# EAGLE design PCM2904_SoundCard (EAGLE 5.10)
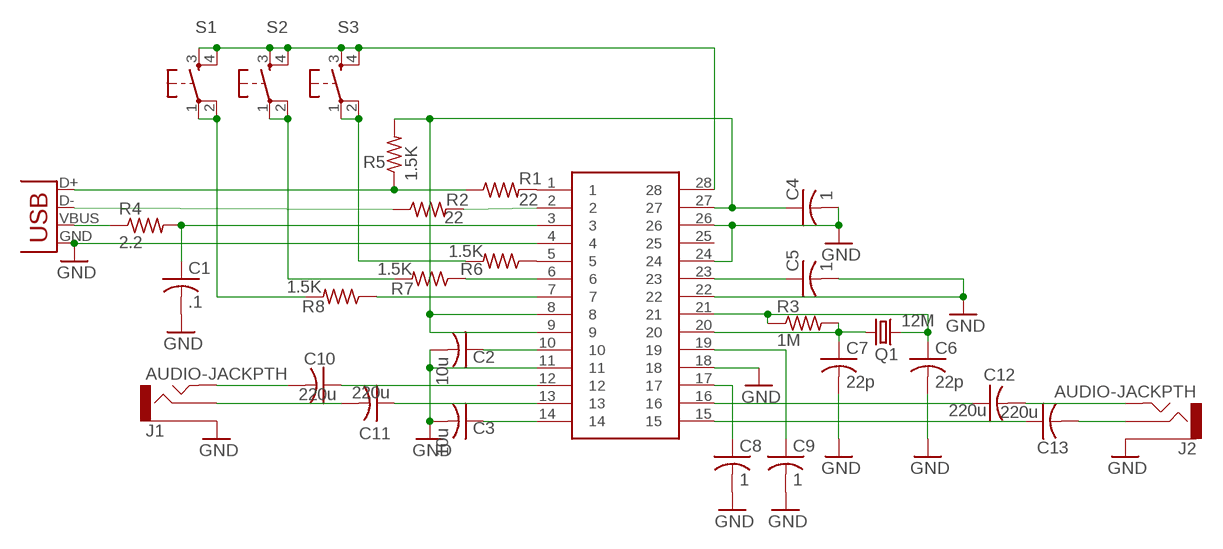
[diagram p0: schematic, sheet 1]

## Parts
C1  .1  C-USC0805  [C0805]
C2  10u  C-USC1210  [C1210]
C3  10u  C-USC1210  [C1210]
C4  1  C-USC1210  [C1210]
C5  1  C-USC1210  [C1210]
C6  22p  C-USC0805  [C0805]
C7  22p  C-USC0805  [C0805]
C8  1  C-USC1210  [C1210]
C9  1  C-USC1210  [C1210]
C10  220u  C-USC1210  [C1210]
C11  220u  C-USC1210  [C1210]
C12  220u  C-USC1210  [C1210]
C13  220u  C-USC1210  [C1210]
J1  AUDIO-JACKPTH  [AUDIO-JACK]
J2  AUDIO-JACKPTH  [AUDIO-JACK]
PCM2904  SSOP28  [SSOP28DB]
Q1  12M  CRYSTALHC49US  [HC49US]
R1  22  R-US_R0805  [R0805]
R2  22  R-US_R0805  [R0805]
R3  1M  R-US_R0805  [R0805]
R4  2.2  R-US_R0805  [R0805]
R5  1.5K  R-US_R0805  [R0805]
R6  1.5K  R-US_R0805  [R0805]
R7  1.5K  R-US_R0805  [R0805]
R8  1.5K  R-US_R0805  [R0805]
S1  TAC_SWITCHPTH  [TACTILE-PTH]
S2  TAC_SWITCHPTH  [TACTILE-PTH]
S3  TAC_SWITCHPTH  [TACTILE-PTH]
X2  USBSMD  [USB-MINIB]

## Nets
GND: C1.2 C2.2 C3.2 C4.2 C5.2 C6.2 C7.2 C8.2 C9.2 J1.1 J2.1 PCM2904.4 PCM2904.11 PCM2904.18 PCM2904.22 PCM2904.24 PCM2904.26 X2.GND
N$1: PCM2904.1 R1.2
N$2: PCM2904.2 R2.2
N$3: C6.1 PCM2904.21 Q1.2 R3.1
N$4: R1.1 R5.1 X2.D+
N$5: R2.1 X2.D-
N$6: R4.1 X2.VBUS
N$7: C1.1 PCM2904.3 R4.2
N$8: C4.1 PCM2904.8 PCM2904.9 PCM2904.27 R5.2
N$9: C5.1 PCM2904.23
N$10: C2.1 PCM2904.10
N$11: C3.1 PCM2904.14
N$12: C10.2 J1.5
N$13: C10.1 PCM2904.12
N$14: C8.1 PCM2904.17
N$15: C11.2 J1.2
N$16: C9.1 PCM2904.19
N$19: C7.1 PCM2904.20 Q1.1 R3.2
N$21: C12.1 PCM2904.16
N$22: C12.2 J2.5
N$24: C11.1 PCM2904.13
N$25: C13.1 PCM2904.15
N$26: C13.2 J2.2
N$27: PCM2904.5 R6.1
N$28: PCM2904.6 R7.1
N$29: PCM2904.7 R8.1
N$30: R6.2 S3.1 S3.2
N$31: R7.2 S2.1 S2.2
N$32: R8.2 S1.1 S1.2
N$33: PCM2904.28 S1.3 S1.4 S2.3 S2.4 S3.3 S3.4
Unconnected: PCM2904.25

## Library data of the parts
C1-C13 = resistor:C-US: CAPACITOR, American symbol
J1 J2 = SparkFun:AUDIO-JACK: 3.5mm Audio Jack Simple 3.5mm common PCB mount audio jack. SKU: PRT-08032
PCM2904 = SparkFun:SSOP28
Q1 = SparkFun:CRYSTAL: Crystals Various standard crystals. Proven footprints. Spark Fun Electronics SKU : COM-00534
R1-R8 = resistor:R-US_: RESISTOR, American symbol
S1-S3 = SparkFun:TAC_SWITCH: Momentary Switch Button commonly used for reset or general input. Spark Fun Electronics SKU : COM-00097
X2 = SparkFun:USB: USB Connectors USB-B-PTH is fully proven SKU : PRT-00139 USB-miniB is fully proven SKU : PRT-00587 USB-A-PCB is untested. USB-A-H is throughly reviewed, but untested. Spark Fun Electronics SKU : PRT-00437 USB-B-SMT is throughly reviewed, but untested. Needs silkscreen touching up. USB-A-S has not been used/tested USB-MB-H has not been used/tested

## Board
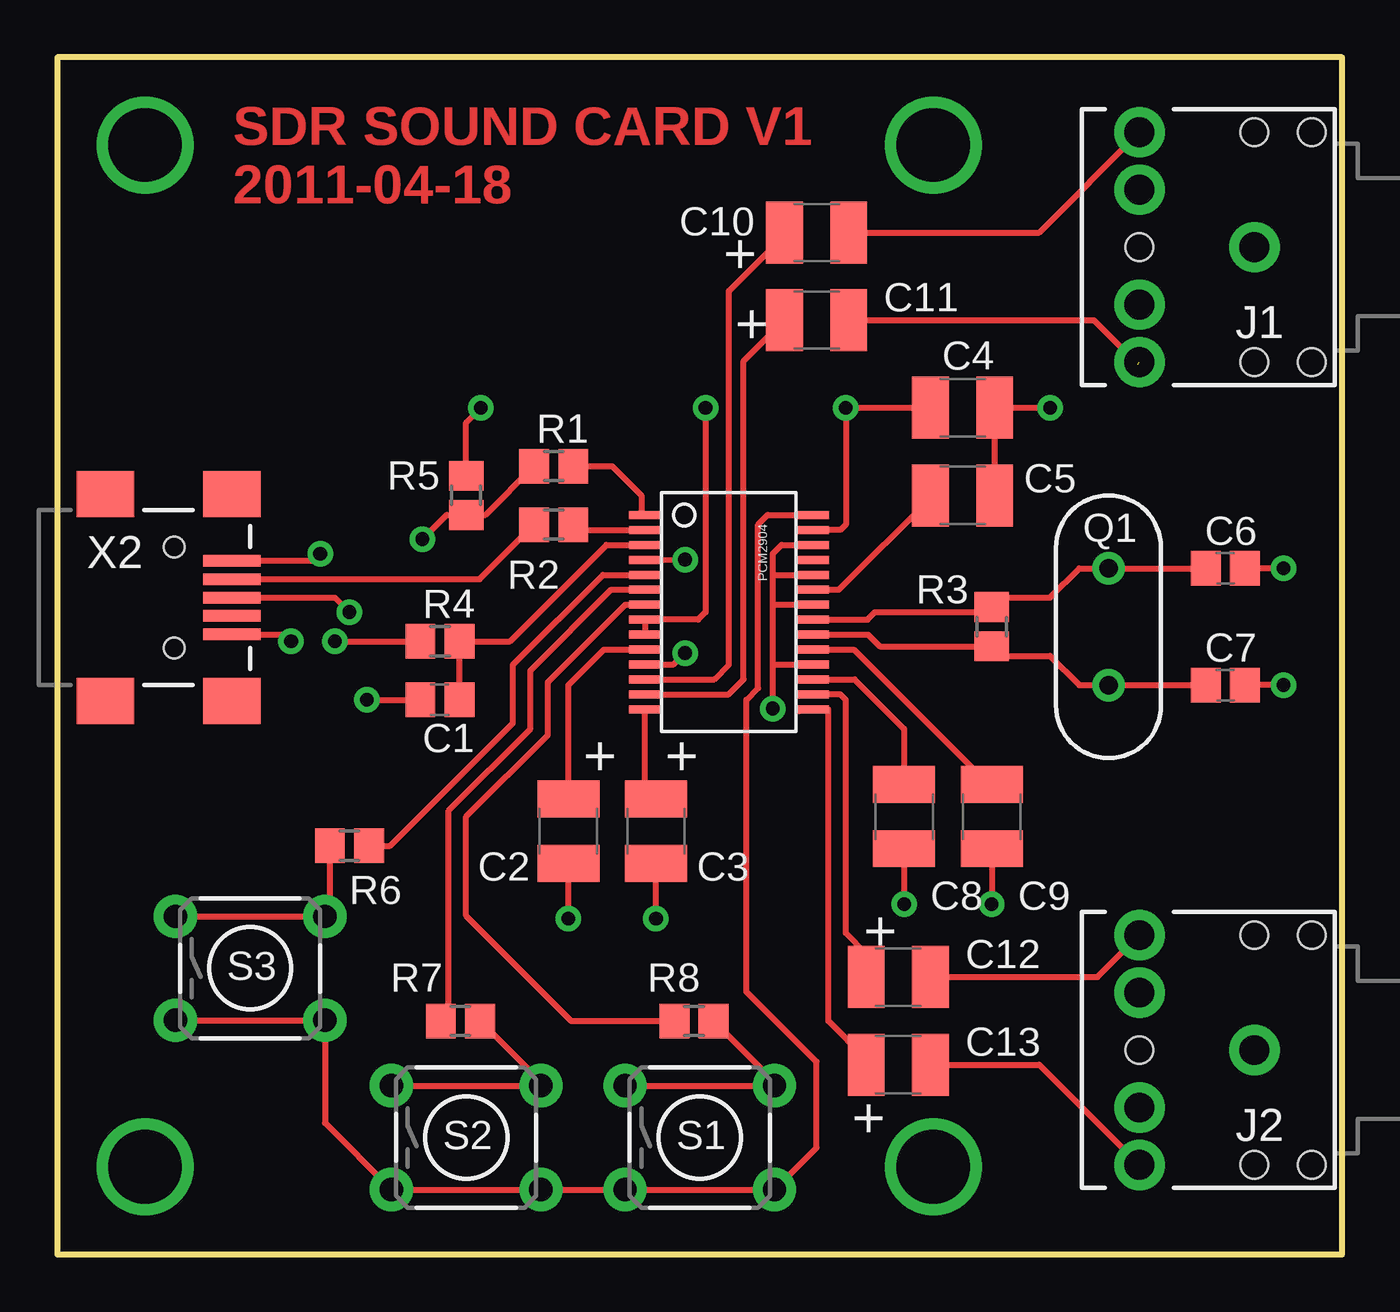
[diagram p1: board, top side]
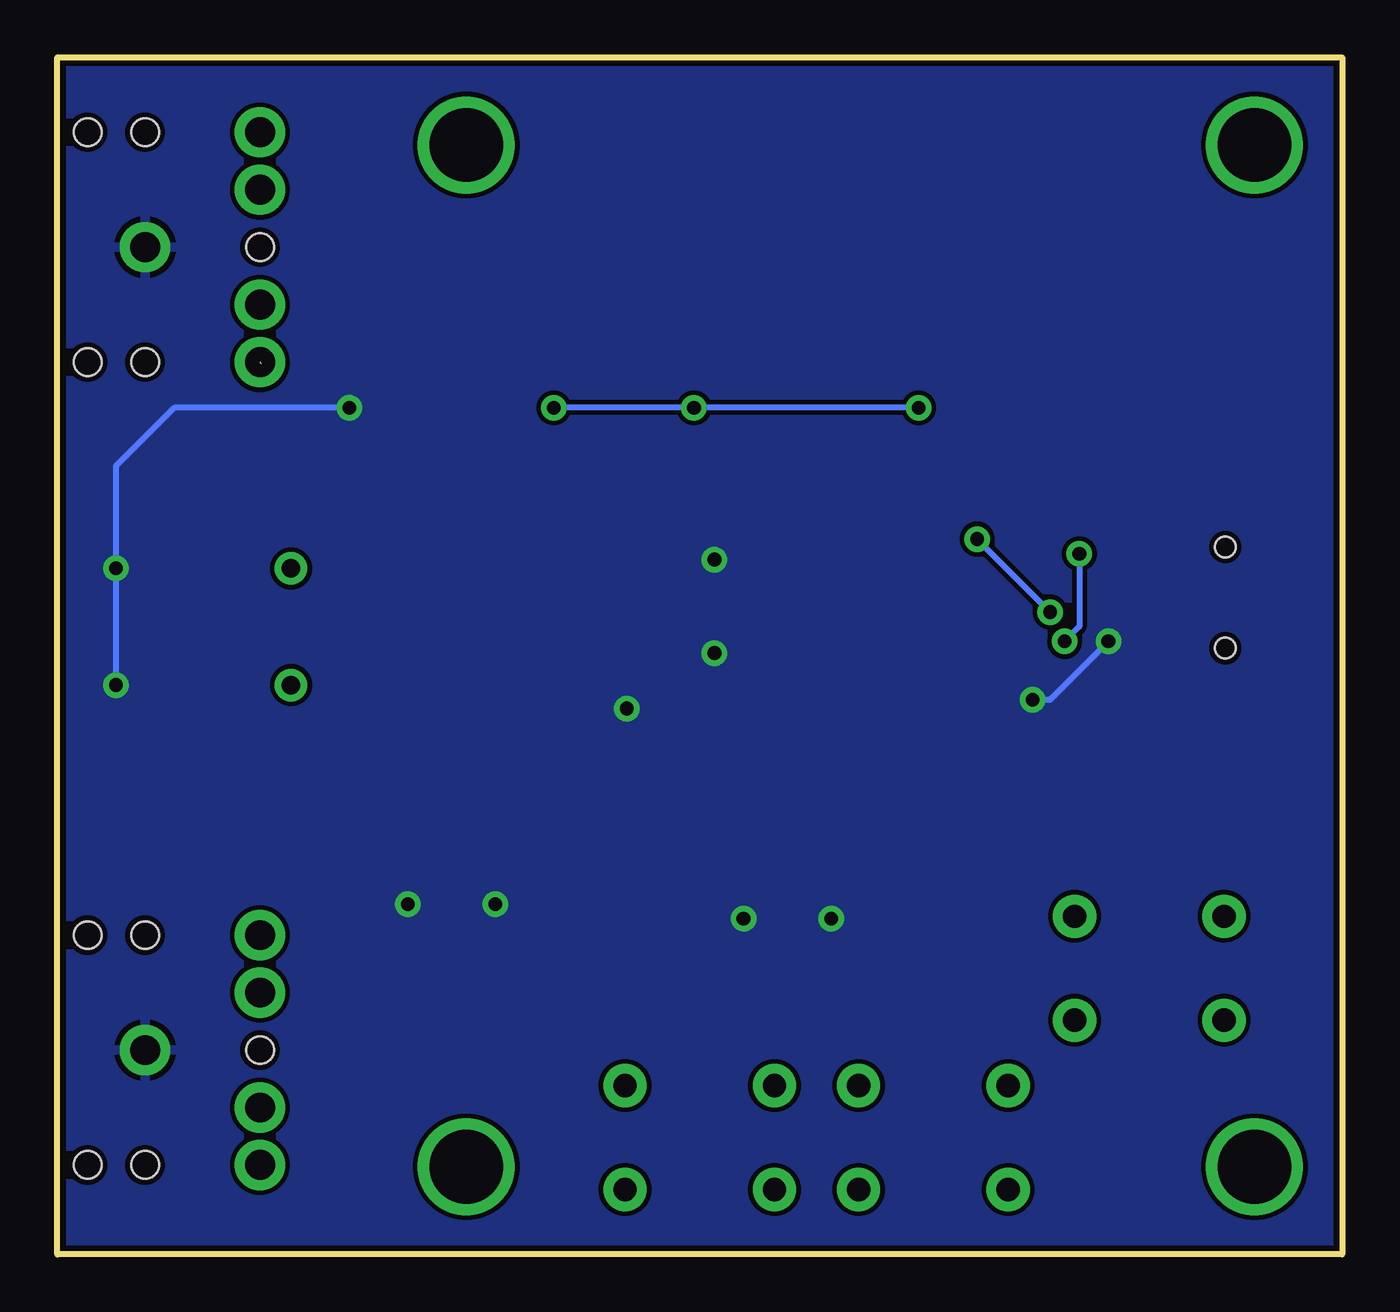
[diagram p2: board, bottom side, seen from below]

Size 55.88 x 52.07 mm. Coordinates in mm from the lower left corner, seen from the top.
Outline: 0,0 55.88,0 55.88,52.07 0,52.07 0,0
Copper layers (1*16): Top 0.035mm / dielectric 1.5mm / Bottom 0.035mm
Design rules "SparkFun": minimum track width 8mil, minimum drill 20mil, track to track 8mil, track to pad 8mil, pad to pad 8mil, via to via 8mil, smd to smd 8mil, copper to edge 10mil, drill to drill 8mil, minimum pad ring 12mil, minimum via ring 10mil, stop-mask expansion 4mil, vias tented up to drill 25mil, thermal gap 10mil

### Footprints (pad centres in the part's own frame; a part is rotated, then mirrored left to right if it is on the bottom)
C0805 = smd 1.3 x 1.5: 1 -0.85,0; 2 0.85,0
C1210 = smd 1.6 x 2.7: 1 -1.4,0; 2 1.4,0
AUDIO-JACK = drill 1.3 pad 2.184 round: 1 0,0; 2 5,5; 3 5,2.5; 4 5,-2.5; 5 5,-5 | hole 1.2: 0,5; -2.5,5; -2.5,-5; 0,-5; 5,0
SSOP28DB = smd 0.348 x 1.397: 1 -4.225,-3.656; 2 -3.575,-3.656; 3 -2.925,-3.656; 4 -2.275,-3.656; 5 -1.625,-3.656; 6 -0.975,-3.656; 7 -0.325,-3.656; 8 0.325,-3.656; 9 0.975,-3.656; 10 1.625,-3.656; 11 2.275,-3.656; 12 2.925,-3.656; 13 3.575,-3.656; 14 4.225,-3.656; 15 4.225,3.656; 16 3.575,3.656; 17 2.925,3.656; 18 2.275,3.656; 19 1.625,3.656; 20 0.975,3.656; 21 0.325,3.656; 22 -0.325,3.656; 23 -0.975,3.656; 24 -1.625,3.656; 25 -2.275,3.656; 26 -2.925,3.656; 27 -3.575,3.656; 28 -4.225,3.656
HC49US = drill 0.813 round: 1 -2.54,0; 2 2.54,0
R0805 = smd 1.3 x 1.5: 1 -0.85,0; 2 0.85,0
TACTILE-PTH = drill 1.016 pad 1.88 round: 1 -3.251,2.261; 2 3.251,2.261; 3 -3.251,-2.261; 4 3.251,-2.261
USB-MINIB = smd 2.5 x 0.5: D+ 2.5,0; D- 2.5,0.8; GND 2.5,-1.6; ID 2.5,-0.8; VBUS 2.5,1.6 | smd 2.5 x 2: GND@1 -3,-4.5; GND@2 -3,4.5; GND@3 2.5,4.5; GND@4 2.5,-4.5 | hole 0.9: 0,2.2; 0,-2.2

### Placement (x,y rotation side)
C1  16.64,24.13 180 top
C2  22.23,18.41 270 top
C3  26.04,18.41 270 top
C4  39.37,36.83 0 top
C5  39.37,33.02 0 top
C6  50.8,29.84 0 top
C7  50.8,24.77 0 top
C8  36.83,19.05 270 top
C9  40.64,19.05 270 top
C10  33.02,44.45 0 top
C11  33.02,40.64 0 top
C12  36.58,12.06 0 top
C13  36.58,8.26 0 top
J1  52.07,43.81 180 top
J2  52.07,8.89 180 top
PCM2904  29.21,27.94 270 top
Q1  45.72,27.3 90 top
R1  21.59,34.29 0 top
R2  21.59,31.75 0 top
R3  40.64,27.3 270 top
R4  16.64,26.67 0 top
R5  17.78,33.02 90 top
R6  12.7,17.78 180 top
R7  17.53,10.16 0 top
R8  27.69,10.16 0 top
S1  27.94,5.08 0 top
S2  17.78,5.08 0 top
S3  8.38,12.45 0 top
X2  5.08,28.57 0 top

### Tracks (layer width: path | path; a pad name or v marks a point on that pad's centre or on a via)
GND  (via drill 0.6)
  Top 0.254: 31.11,29.57 PCM2904.24 | v13.46,24.13 C1.2 | v53.34,29.84 C6.2 | v53.34,24.77 C7.2 | PCM2904.26 31.5,30.86 31.11,30.48 31.11,29.57 | 31.11,28.27 31.11,29.57 | 31.11,28.27 PCM2904.22 | C5.2 C4.2 v43.18,36.83 | X2.GND 9.86,26.98 v10.16,26.67 | C8.2 v36.83,15.24 | C9.2 v40.64,15.24 | v22.23,14.61 C2.2 | v26.04,14.61 C3.2 | PCM2904.4 26.3,30.21 v27.3,30.23 | v31.11,23.75 31.11,25.65 | 31.11,25.65 31.11,28.27 | PCM2904.11 26.81,25.66 v27.3,26.16 | PCM2904.18 31.13,25.66 31.11,25.65
  Bottom 0.254: v53.34,24.77 v53.34,29.84 53.34,34.29 50.8,36.83 v43.18,36.83 | v13.46,24.13 12.7,24.13 v10.16,26.67
  pour Bottom: 0,52.07 55.88,52.07 55.88,0 0,0
N$1
  Top 0.254: R1.2 24.13,34.29 25.4,33.02 25.4,32.32 PCM2904.1
N$2
  Top 0.254: PCM2904.2 22.68,31.52 arc-90 R2.2
N$3
  Top 0.254: PCM2904.21 35.23,27.61 35.56,27.94 40.42,27.94 R3.1 41.06,28.57 43.18,28.57 44.45,29.84 Q1.2 C6.1
N$4  (via drill 0.6)
  Top 0.254: R1.1 18.62,32.17 R5.1 16.93,32.17 v15.88,31.11 | X2.D+ 12.06,28.57 v12.7,27.94
  Bottom 0.254: v12.7,27.94 v15.88,31.11
N$5
  Top 0.254: X2.D- 18.36,29.38 R2.1
N$6  (via drill 0.6)
  Top 0.254: v12.06,26.67 R4.1 | X2.VBUS 11.12,30.18 v11.43,30.48
  Bottom 0.254: v11.43,30.48 11.43,27.3 v12.06,26.67
N$7
  Top 0.254: PCM2904.3 23.88,30.86 19.68,26.67 R4.2 C1.1
N$8  (via drill 0.6)
  Top 0.254: PCM2904.9 PCM2904.8 27.87,27.61 28.19,27.94 v28.19,36.83 | R5.2 17.78,36.2 v18.41,36.83 | PCM2904.27 34.05,31.52 34.29,31.75 v34.29,36.83 C4.1
  Bottom 0.254: v18.41,36.83 v28.19,36.83 v34.29,36.83
N$9
  Top 0.254: C5.1 37.97,32.89 33.99,28.91 PCM2904.23
N$10
  Top 0.254: PCM2904.10 23.77,26.32 22.23,24.77 C2.1
N$11
  Top 0.254: PCM2904.14 25.55,20.3 C3.1
N$12
  Top 0.254: C10.2 42.7,44.45 J1.5
N$13
  Top 0.254: PCM2904.12 28.57,25.02 29.21,25.65 29.21,41.91 31.62,44.32 C10.1
N$14
  Top 0.254: PCM2904.17 34.67,25.02 36.83,22.86 C8.1
N$15  (1 unrouted)
  Top 0.254: 46.99,38.73 45.09,40.64 C11.2
N$16
  Top 0.254: PCM2904.19 34.65,26.32 40.64,20.32 C9.1
N$17  (via drill 3.2)
  other vias: 3.81,3.81
N$18  (via drill 3.2)
  other vias: 3.81,48.26
N$19
  Top 0.254: PCM2904.20 35.27,26.96 35.77,26.45 R3.2 41.06,26.04 43.18,26.04 44.45,24.77 Q1.1 C7.1
N$20  (via drill 3.2)
  other vias: 38.1,48.26
N$21
  Top 0.254: PCM2904.16 34.05,24.36 34.29,24.13 34.29,13.97 35.18,13.08 C12.1
N$22
  Top 0.254: C12.2 45.24,12.06 J2.5
N$23  (via drill 3.2)
  other vias: 38.1,3.81
N$24
  Top 0.254: PCM2904.13 29.19,24.36 29.84,25.02 29.84,38.87 C11.1
N$25
  Top 0.254: 32.26,23.62 32.35,23.71 PCM2904.15 33.53,23.71 33.53,10.16 35.18,8.51 C13.1
N$26
  Top 0.254: C13.2 42.7,8.26 J2.2
N$27
  Top 0.254: PCM2904.5 23.72,29.57 19.81,25.65 19.81,23.11 14.48,17.78 R6.1
N$28
  Top 0.254: PCM2904.6 24.09,28.91 20.57,25.4 20.57,22.86 17.02,19.3 17.02,10.5 R7.1
N$29
  Top 0.254: PCM2904.7 24.71,28.27 21.34,24.89 21.34,22.61 17.78,19.05 17.78,14.73 22.35,10.16 R8.1
N$30
  Top 0.254: S3.1 S3.2 11.85,14.92 R6.2
N$31
  Top 0.254: S2.1 S2.2 21.03,7.5 R7.2
N$32
  Top 0.254: S1.1 S1.2 31.19,7.5 R8.2
N$33
  Top 0.254: S3.3 S3.4 11.63,5.71 S2.3 S2.4 S1.3 S1.4 33.02,4.65 33.02,8.38 29.97,11.43 29.97,24.13 30.48,24.64 30.48,31.75 30.89,32.16 PCM2904.28

### Text on the board
Top: SDR SOUND CARD V1 | 2011-04-18
tNames: + | + | + | + | + | +